# EAGLE design SENSOR CAMERA 003 (EAGLE 5.10)
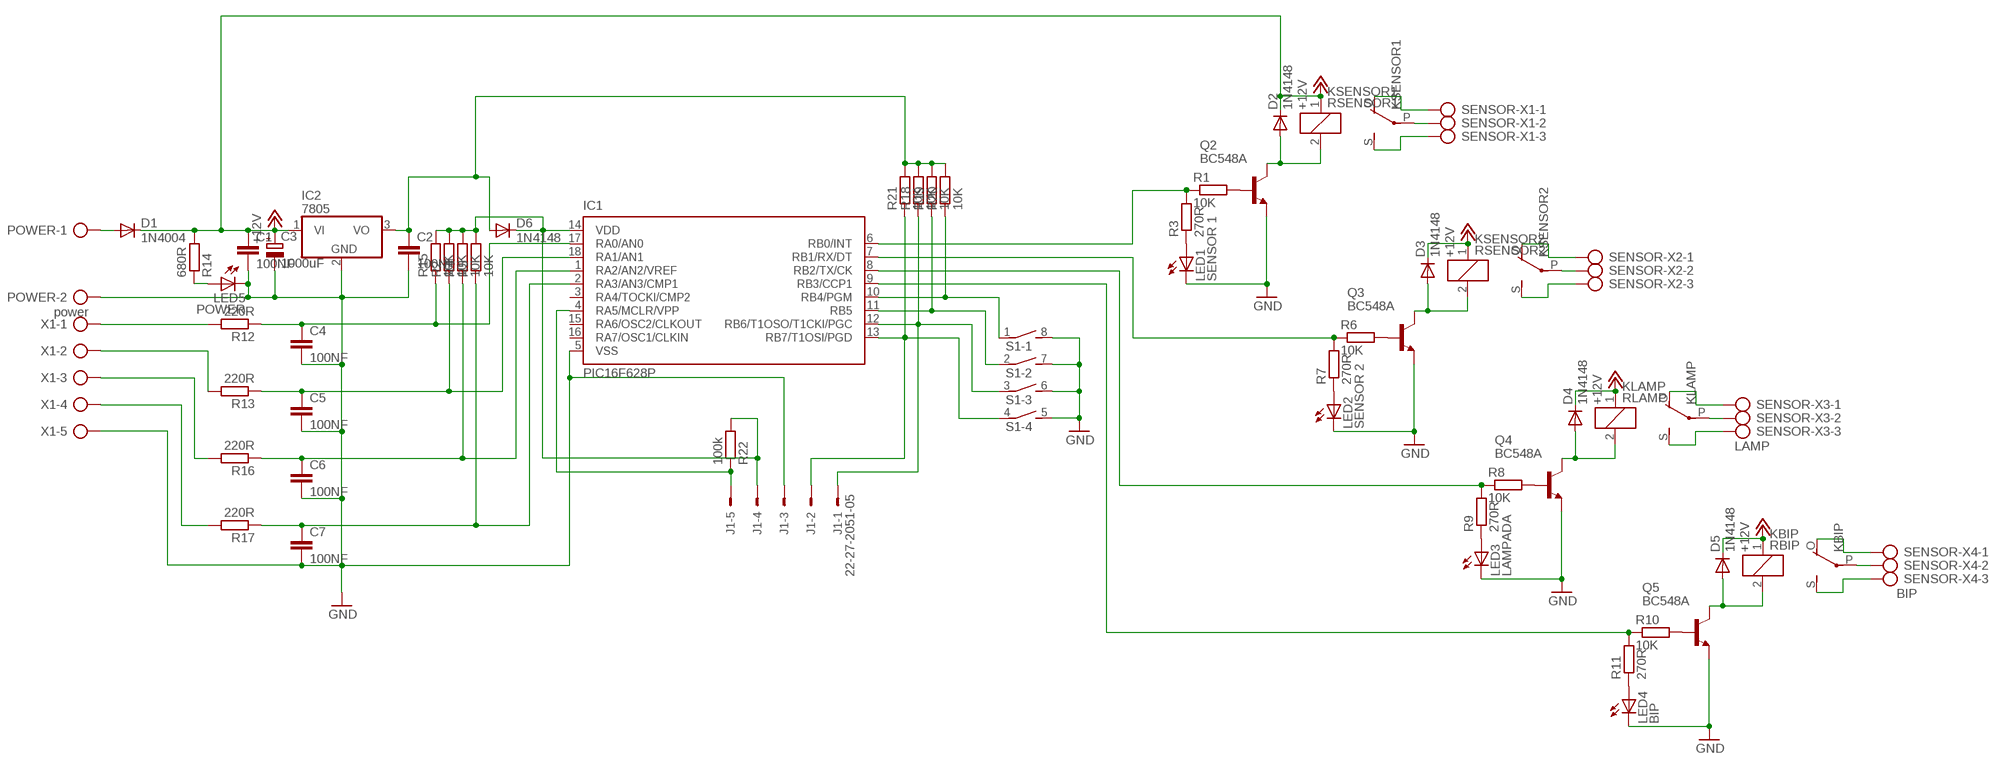
[diagram p0: schematic, sheet 1]

## Parts
C1  100NF  C-EU075-032X103  [C075-032X103]
C2  100NF  C-EU075-032X103  [C075-032X103]
C3  1000uF  CPOL-EUE5-10.5  [E5-10,5]
C4  100NF  C-EU075-032X103  [C075-032X103]
C5  100NF  C-EU075-032X103  [C075-032X103]
C6  100NF  C-EU075-032X103  [C075-032X103]
C7  100NF  C-EU075-032X103  [C075-032X103]
D1  1N4004  [DO41-10]
D2  1N4148  1N4148DO35-7  [DO35-7]
D3  1N4148  1N4148DO35-7  [DO35-7]
D4  1N4148  1N4148DO35-7  [DO35-7]
D5  1N4148  1N4148DO35-7  [DO35-7]
D6  1N4148  1N4148DO35-7  [DO35-7]
IC1  PIC16F628P  [DIL18]
IC2  7805  7805TV  [TO220V]
J1  22-27-2051-05  [6410-05]
KBIP  RBIP  G5LE  [G5LE]
KLAMP  RLAMP  G5LE  [G5LE]
KSENSOR1  RSENSOR1  G5LE  [G5LE]
KSENSOR2  RSENSOR2  G5LE  [G5LE]
LED1  SENSOR 1  LED5MM  [LED5MM]
LED2  SENSOR 2  LED5MM  [LED5MM]
LED3  LAMPADA  LED5MM  [LED5MM]
LED4  BIP  LED5MM  [LED5MM]
LED5  POWER  LED5MM  [LED5MM]
POWER  power  AK500/2-H  [AK500/2-H]
Q2  BC548A  [TO92-EBC]
Q3  BC548A  [TO92-EBC]
Q4  BC548A  [TO92-EBC]
Q5  BC548A  [TO92-EBC]
R1  10K  R-EU_0207/10  [0207/10]
R2  10K  R-EU_0207/10  [0207/10]
R3  270R  R-EU_0207/10  [0207/10]
R4  10K  R-EU_0207/10  [0207/10]
R5  10K  R-EU_0207/10  [0207/10]
R6  10K  R-EU_0207/10  [0207/10]
R7  270R  R-EU_0207/10  [0207/10]
R8  10K  R-EU_0207/10  [0207/10]
R9  270R  R-EU_0207/10  [0207/10]
R10  10K  R-EU_0207/10  [0207/10]
R11  270R  R-EU_0207/10  [0207/10]
R12  220R  R-EU_0207/10  [0207/10]
R13  220R  R-EU_0207/10  [0207/10]
R14  680R  R-EU_0207/10  [0207/10]
R15  10K  R-EU_0207/10  [0207/10]
R16  220R  R-EU_0207/10  [0207/10]
R17  220R  R-EU_0207/10  [0207/10]
R18  10K  R-EU_0207/10  [0207/10]
R19  10K  R-EU_0207/10  [0207/10]
R20  10K  R-EU_0207/10  [0207/10]
R21  10K  R-EU_0207/10  [0207/10]
R22  100k  R-EU_0207/10  [0207/10]
S1  DIP04S  [DIP04S]
SENSOR-X1  AK500/3-H  [AK500/3-H]
SENSOR-X2  AK500/3-H  [AK500/3-H]
SENSOR-X3  LAMP  AK500/3-H  [AK500/3-H]
SENSOR-X4  BIP  AK500/3-H  [AK500/3-H]
X1  AK500/5-H  [AK500/5-H]

## Nets
+12V: C1.1 C3.+ D1.C D2.C D3.C D4.C D5.C IC2.1(VI) KBIP.1 KLAMP.1 KSENSOR1.1 KSENSOR2.1 R14.2
GND: C1.2 C2.2 C3.- C4.2 C5.2 C6.2 C7.2 IC1.5(VSS) IC2.2(GND) J1.3 LED1.K(C) LED2.K(C) LED3.K(C) LED4.K(C) LED5.K(C) POWER.2 Q2.E Q3.E Q4.E Q5.E S1.5 S1.6 S1.7 S1.8 X1.5
N$1: D1.A POWER.1
N$2: C6.1 IC1.1(RA2/AN2/VREF) R4.1 R16.1
N$3: IC1.6(RB0/INT) R1.1 R3.2
N$4: C2.1 D6.A IC2.3(VO) R18.2 R19.2 R20.2 R21.2
N$5: KSENSOR1.P(2:P) SENSOR-X1.2
N$6: KSENSOR1.O(2:O) SENSOR-X1.1
N$7: KSENSOR1.S(2:S) SENSOR-X1.3
N$8: D2.A KSENSOR1.2 Q2.C
N$9: LED1.A R3.1
N$10: Q2.B R1.2
N$11: C7.1 IC1.2(RA3/AN3/CMP1) R5.1 R17.1
N$12: C5.1 IC1.18(RA1/AN1) R2.1 R13.1
N$13: IC1.4(RA5/MCLR/VPP) J1.5 R22.1
N$14: C4.1 IC1.17(RA0/AN0) R12.1 R15.1
N$15: IC1.10(RB4/PGM) R20.1 S1.1
N$16: KSENSOR2.P(2:P) SENSOR-X2.2
N$17: KSENSOR2.O(2:O) SENSOR-X2.1
N$18: KSENSOR2.S(2:S) SENSOR-X2.3
N$19: D3.A KSENSOR2.2 Q3.C
N$20: Q3.B R6.2
N$21: IC1.11(RB5) R19.1 S1.2
N$22: LED2.A R7.1
N$23: KLAMP.P(2:P) SENSOR-X3.2
N$24: KLAMP.O(2:O) SENSOR-X3.1
N$25: KLAMP.S(2:S) SENSOR-X3.3
N$26: D4.A KLAMP.2 Q4.C
N$27: Q4.B R8.2
N$28: IC1.8(RB2/TX/CK) R8.1 R9.2
N$29: LED3.A R9.1
N$30: KBIP.P(2:P) SENSOR-X4.2
N$31: KBIP.O(2:O) SENSOR-X4.1
N$32: KBIP.S(2:S) SENSOR-X4.3
N$33: D5.A KBIP.2 Q5.C
N$34: Q5.B R10.2
N$35: IC1.12(RB6/T1OSO/T1CKI/PGC) J1.1 R18.1 S1.3
N$36: LED4.A R11.1
N$37: IC1.9(RB3/CCP1) R10.1 R11.2
N$38: IC1.7(RB1/RX/DT) R6.1 R7.2
N$39: IC1.13(RB7/T1OSI/PGD) J1.2 R21.1 S1.4
N$40: LED5.A R14.1
N$41: D6.C IC1.14(VDD) J1.4 R2.2 R4.2 R5.2 R15.2 R22.2
N$42: R12.2 X1.1
N$43: R13.2 X1.2
N$44: R16.2 X1.3
N$45: R17.2 X1.4
Unconnected: IC1.3(RA4/TOCKI/CMP2) IC1.15(RA6/OSC2/CLKOUT) IC1.16(RA7/OSC1/CLKIN)

## Library data of the parts
C1 C2 C4-C7 = rcl:C-EU: CAPACITOR, European symbol
C3 = rcl:CPOL-EU: POLARIZED CAPACITOR, European symbol
D1 = diode:1N4004: DIODE general purpose rectifier, 1 A
D2-D6 = diode:1N4148: DIODE high speed (Philips)
IC1 = microchip:PIC16F62*: FLASH-Based 8-Bit CMOS Microcontroller Source: http://ww1.microchip.com/downloads/en/DeviceDoc/40300C.pdf
IC2 = linear:78*: Positive VOLTAGE REGULATOR Source: http://cache.national.com/ds/LM/LM78L05.pdf http://www.fairchildsemi.com/ds/LM/LM7805.pdf
J1 = con-molex:22-?-05: CONNECTOR wire to board 2.54 mm (.1 inch) pitch header
KBIP KLAMP KSENSOR1 KSENSOR2 = relay:G5LE: RELAY 1 x switch, 10 A/120 V AC, 8 A/30 V DC, Omron
LED1-LED5 = led:LED: LED OSRAM: - CHIPLED LG R971, LG N971, LY N971, LG Q971, LY Q971, LO R971, LY R971 LH N974, LH R974 LS Q976, LO Q976, LY Q976 LO Q996 - Hyper CHIPLED LW Q18S LB Q993, LB Q99A, LB R99A - SideLED LS A670, LO A670, LY A670, LG A670, LP A670 LB A673, LV A673, LT A673, LW A673 LH A674 LY A675 LS A676, LA A676, LO A676, LY A676, LW A676 LS A679, LY A679, LG A679 - Hyper Micro SIDELED® LS Y876, LA Y876, LO Y876, LY Y876 LT Y87S - SmartLED LW L88C, LW L88S LB L89C, LB L89S, LG L890 LS L89K, LO L89K, LY L89K LS L896, LA L896, LO L896, LY L896 - TOPLED LS T670, LO T670, LY T670, LG T670, LP T670 LSG T670, LSP T670, LSY T670, LOP T670, LYG T670 LG T671, LOG T671, LSG T671 LB T673, LV T673, LT T673, LW T673 LH T674 LS T676, LA T676, LO T676, LY T676, LB T676, LH T676, LSB T676, LW T676 LB T67C, LV T67C, LT T67C, LS T67K, LO T67K, LY T67K, LW E67C LS E67B, LA E67B, LO E67B, LY E67B, LB E67C, LV E67C, LT E67C LW T67C LS T679, LY T679, LG T679 LS T770, LO T770, LY T770, LG T770, LP T770 LB T773, LV T773, LT T773, LW T773 LH T774 LS E675, LA E675, LY E675, LS T675 LS T776, LA T776, LO T776, LY T776, LB T776 LHGB T686 LT T68C, LB T68C - Hyper Mini TOPLED® LB M676 - Mini TOPLED Santana® LG M470 LS M47K, LO M47K, LY M47K Source: http://www.osram.convergy.de LUXEON: - LUMILED® LXK2-PW12-R00, LXK2-PW12-S00, LXK2-PW14-U00, LXK2-PW14-V00 LXK2-PM12-R00, LXK2-PM12-S00, LXK2-PM14-U00 LXK2-PE12-Q00, LXK2-PE12-R00, LXK2-PE12-S00, LXK2-PE14-T00, LXK2-PE14-U00 LXK2-PB12-K00, LXK2-PB12-L00, LXK2-PB12-M00, LXK2-PB14-N00, LXK2-PB14-P00, LXK2-PB14-Q00 LXK2-PR12-L00, LXK2-PR12-M00, LXK2-PR14-Q00, LXK2-PR14-R00 LXK2-PD12-Q00, LXK2-PD12-R00, LXK2-PD12-S00 LXK2-PH12-R00, LXK2-PH12-S00 LXK2-PL12-P00, LXK2-PL12-Q00, LXK2-PL12-R00 Source: www.luxeon.com KINGBRIGHT: KA-3528ASYC Source: www.kingbright.com
POWER = con-ptr500:AK500/2-H: CONNECTOR Aug. 2004 / PTR Meßtechnik: Die Bezeichnung der Serie AK505 wurde geändert. Es handelt sich hierbei um AK500 in horizontaler Ausführung.
Q2-Q5 = transistor-npn:BC548*: NPN Transistor
R1-R22 = rcl:R-EU_: RESISTOR, European symbol
S1 = switch-dil:DIP04S: DIL/CODE SWITCH
SENSOR-X1-SENSOR-X4 = con-ptr500:AK500/3-H: CONNECTOR Aug. 2004 / PTR Meßtechnik: Die Bezeichnung der Serie AK505 wurde geändert. Es handelt sich hierbei um AK500 in horizontaler Ausführung.
X1 = con-ptr500:AK500/5-H: CONNECTOR Aug. 2004 / PTR Meßtechnik: Die Bezeichnung der Serie AK505 wurde geändert. Es handelt sich hierbei um AK500 in horizontaler Ausführung.

## Board
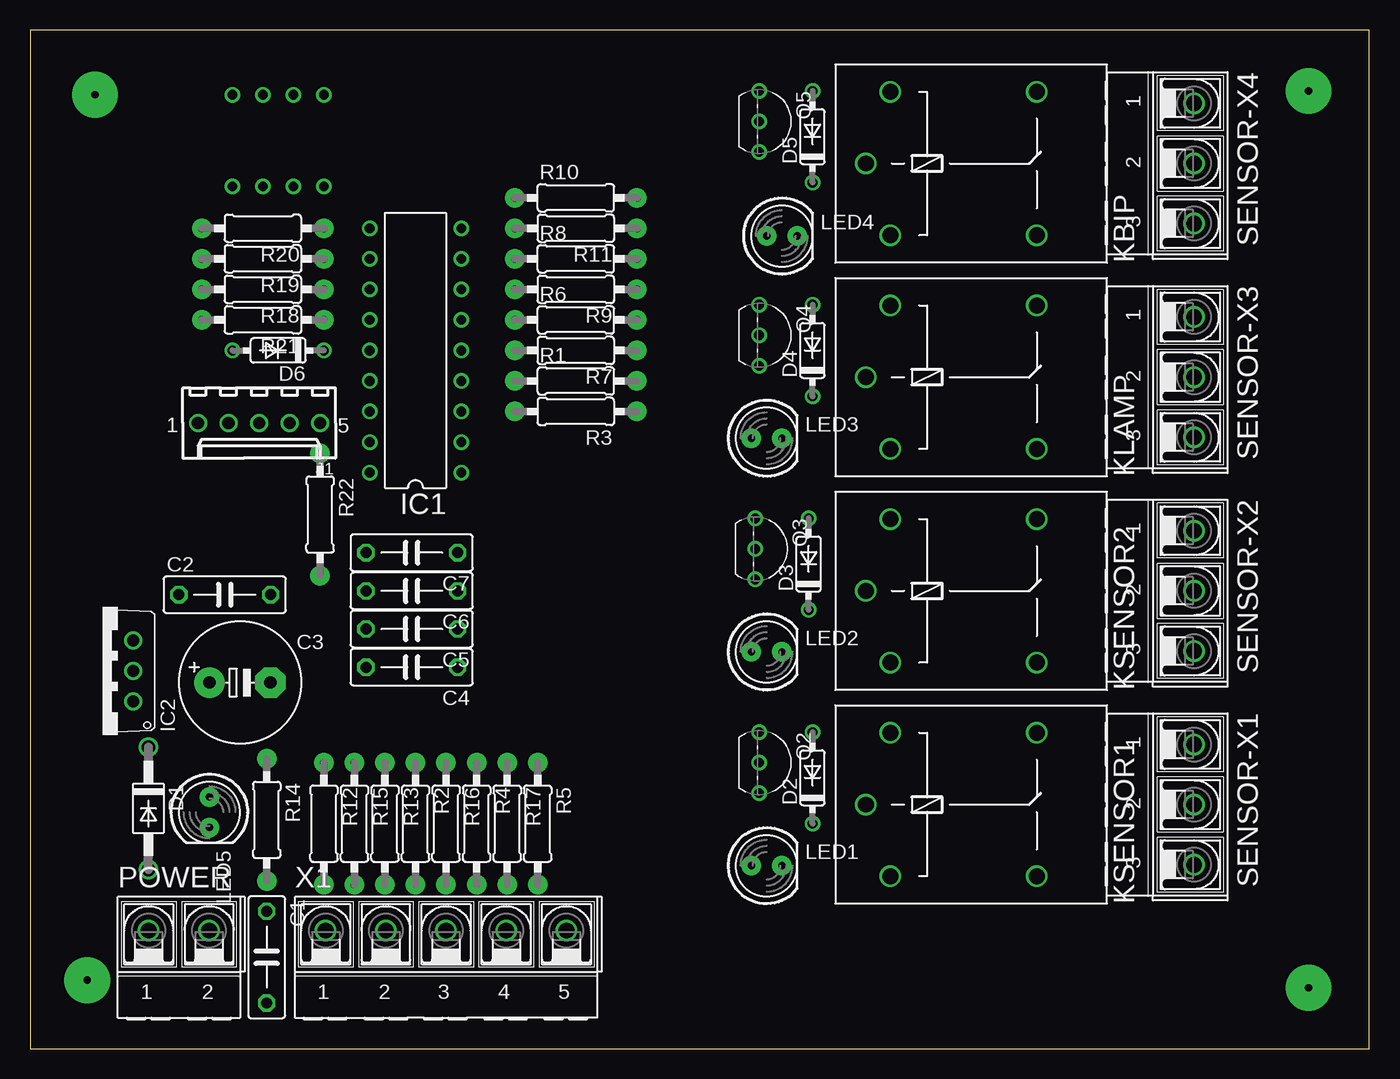
[diagram p1: board, top side]
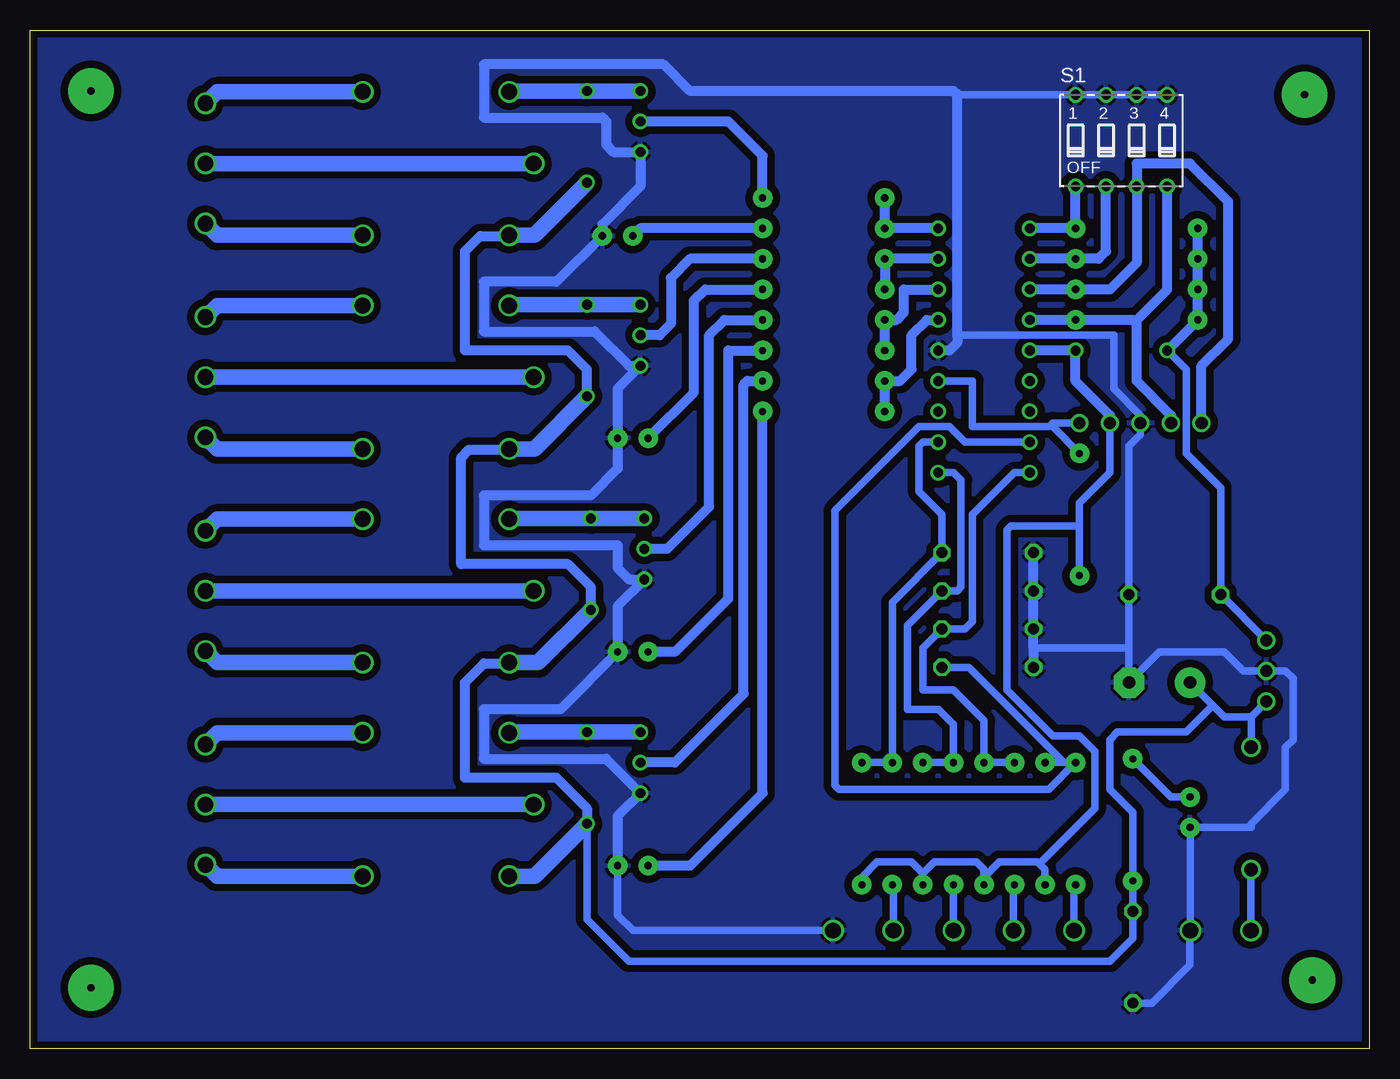
[diagram p2: board, bottom side, seen from below]

Size 111.42 x 84.76 mm. Coordinates in mm from the lower left corner, seen from the top.
Outline: 0,0 111.42,0 111.42,84.76 0,84.76 0,0
Copper layers (1*16): Top 0.035mm / dielectric 1.5mm / Bottom 0.035mm
Design rules "MUITO BOM FONTE *": minimum track width 25mil, minimum drill 5mil, track to track 10mil, track to pad 10mil, pad to pad 10mil, via to via 10mil, smd to smd 10mil, copper to edge 10mil, drill to drill 10mil, minimum pad ring 10mil, minimum via ring 10mil, stop-mask expansion 4mil, vias tented up to drill 0mil, thermal gap 10mil

### Footprints (pad centres in the part's own frame; a part is rotated, then mirrored left to right if it is on the bottom)
C075-032X103 = drill 0.914 octagon: 1 -3.81,0; 2 3.81,0
E5-10,5 = drill 1.016 pad 2.54 round: + -2.54,0 | drill 1.016 pad 2.54 octagon: - 2.54,0
DO41-10 = drill 1.118 round: A 5.08,0; C -5.08,0
DO35-7 = drill 0.813 long: A 3.81,0; C -3.81,0
DIL18 = drill 0.813 long: 1 -10.16,-3.81; 2 -7.62,-3.81; 3 -5.08,-3.81; 4 -2.54,-3.81; 5 0,-3.81; 6 2.54,-3.81; 7 5.08,-3.81; 8 7.62,-3.81; 9 10.16,-3.81; 10 10.16,3.81; 11 7.62,3.81; 12 5.08,3.81; 13 2.54,3.81; 14 0,3.81; 15 -2.54,3.81; 16 -5.08,3.81; 17 -7.62,3.81; 18 -10.16,3.81
TO220V = drill 1.016 long: 1 -2.54,-2.54; 2 0,-2.54; 3 2.54,-2.54
6410-05 = drill 1.016 long: 1 5.08,0; 2 2.54,0; 3 0,0; 4 -2.54,0; 5 -5.08,0
G5LE = drill 1.321 long: 1 -7.493,-5.969; 2 -7.493,5.969; O 4.699,5.969; P -9.525,0; S 4.699,-5.969
LED5MM = drill 0.6 pad 1.676 long: A -1.27,0; K 1.27,0
AK500/2-H = drill 1.321 long: 1 -2.515,0; 2 2.515,0
TO92-EBC = drill 0.813 long: B 0,-1.27; C -2.54,-1.27; E 2.54,-1.27
0207/10 = drill 0.6 pad 1.676 offset: 1 -5.08,0; 2 5.08,0
DIP04S = drill 0.813 long: 1 -3.81,-3.81; 2 -1.27,-3.81; 3 1.27,-3.81; 4 3.81,-3.81; 5 3.81,3.81; 6 1.27,3.81; 7 -1.27,3.81; 8 -3.81,3.81
AK500/3-H = drill 1.321 long: 1 -5.004,0; 2 0,0; 3 5.004,0
AK500/5-H = drill 1.321 long: 1 -10.033,0; 2 -5.004,0; 3 0,0; 4 5.004,0; 5 10.008,0

### Placement (x,y rotation side)
C1  19.68,7.62 270 top
C2  16.19,37.78 0 top
C3  17.46,30.48 0 top
C4  31.75,31.75 180 top
C5  31.75,34.92 180 top
C6  31.75,38.1 180 top
C7  31.75,41.27 180 top
D1  9.84,20 270 top
D2  65.09,22.54 90 top
D3  64.77,40.32 90 top
D4  65.09,58.1 90 top
D5  65.09,75.88 90 top
D6  20.64,58.1 180 top
IC1  32.07,58.1 90 top
IC2  6.03,31.43 90 top
J1  19.05,52.07 180 top
KBIP  79.06,73.66 0 top
KLAMP  79.06,55.88 0 top
KSENSOR1  79.06,20.32 0 top
KSENSOR2  79.06,38.1 0 top
LED1  61.28,15.24 0 top
LED2  61.28,33.02 0 top
LED3  61.28,50.8 0 top
LED4  62.55,67.63 0 top
LED5  14.92,19.68 270 top
POWER  12.38,9.84 0 top
Q2  61.91,23.81 270 top
Q3  61.59,41.59 270 top
Q4  61.91,59.37 270 top
Q5  61.91,77.15 270 top
R1  45.4,55.56 0 top
R2  32.07,18.73 270 top
R3  45.4,53.02 180 top
R4  37.15,18.73 270 top
R5  42.23,18.73 270 top
R6  45.4,60.64 0 top
R7  45.4,58.1 180 top
R8  45.4,65.72 0 top
R9  45.4,63.18 180 top
R10  45.4,70.8 0 top
R11  45.4,68.26 180 top
R12  24.45,18.73 270 top
R13  29.53,18.73 270 top
R14  19.68,19.05 270 top
R15  26.99,18.73 270 top
R16  34.61,18.73 270 top
R17  39.69,18.73 270 top
R18  19.37,63.18 180 top
R19  19.37,65.72 180 top
R20  19.37,68.26 180 top
R21  19.37,60.64 180 top
R22  24.13,44.45 270 top
S1  20.64,75.56 0 bottom
SENSOR-X1  96.84,20.32 270 top
SENSOR-X2  96.84,38.1 270 top
SENSOR-X3  96.84,55.88 270 top
SENSOR-X4  96.84,73.66 270 top
X1  34.61,9.84 0 top

### Tracks (layer width: path | path; a pad name or v marks a point on that pad's centre or on a via)
+12V
  Bottom 0.61: 9.84,27.62 D1.C | 9.84,27.62 IC2.1 | 9.84,27.62 12.06,27.62 13.02,28.57 | 13.02,28.57 C3.+ | 13.02,28.57 15.24,26.35 20.95,26.35 21.59,25.72 21.59,21.59 19.68,19.68 R14.2 C1.1 19.68,9.21 21.59,7.3 61.59,7.3 65.09,10.79 65.09,20
  Bottom 0.813: D2.C 65.09,20 67.63,22.54 75.25,22.54 75.25,30.48 73.66,32.07 71.63,32.07 KSENSOR2.1 | D3.C 64.77,38.42 66.67,40.32 75.56,40.32 75.56,49.21 74.93,49.85 71.63,49.85 KLAMP.1 | D4.C 65.09,56.52 66.67,58.1 75.25,58.1 75.25,66.36 73.98,67.63 71.63,67.63 KBIP.1
  Bottom 1.27: KSENSOR1.1 69.47,14.35 D2.C | KSENSOR2.1 69.15,32.13 D3.C | KLAMP.1 69.47,49.91 D4.C | KBIP.1 69.47,67.69 D5.C
GND
  Bottom 0.61: J1.3 19.05,52.7 21.27,54.93 21.27,59.37 34.29,59.37 | S1.5 S1.6 S1.7 S1.8 34.29,79.38 | C1.2 18.1,3.81 14.92,6.99 14.92,9.82 POWER.2 14.9,18.39 LED5.K 9.84,18.41 9.84,18.73 6.99,21.59 6.99,25.08 6.35,25.72 6.35,30.8 6.99,31.43 IC2.2 10.48,31.43 12.06,33.02 17.46,33.02 C3.- 20,33.34 C2.2 | X1.5 61.28,9.84 62.55,11.11 LED1.K
  Bottom 0.635: 20,33.34 27.94,33.34 | C2.2 20,50.16 19.05,51.12 J1.3
  Bottom 0.813: LED1.K 62.55,19.37 Q2.E 63.5,24.13 73.66,24.13 73.66,28.26 67.31,28.26 LED2.K 62.55,36.83 Q3.E 61.59,39.05 62.55,40.01 62.55,41.91 73.66,41.91 73.66,46.04 64.77,46.04 62.55,48.26 LED3.K 62.55,54.93 Q4.E 61.59,56.83 64.45,59.69 73.66,59.69 73.66,63.82 67.63,63.82 LED4.K 63.82,68.58 60.64,71.75 Q5.E 62.87,74.61 63.5,75.25 63.5,77.15 63.82,77.47 73.66,77.47 73.66,81.92 58.74,81.92 56.52,79.69 34.61,79.69 34.29,79.38 34.29,59.37 34.29,58.74 34.92,58.1 IC1.5 | C6.2 27.62,37.78 | C4.2 27.94,33.34 C5.2 C6.2 | C6.2 C7.2
  pour Bottom (isolate 0.61): 0,84.77 111.44,84.77 111.44,0 0,0
N$1
  Bottom 0.61: POWER.1 9.87,14.9 D1.A
N$2
  Bottom 0.61: R4.1 R16.1 34.61,26.99 35.88,28.26 38.42,28.26 38.42,35.24 C6.1 34.29,38.1 33.97,38.42 33.97,47.31 34.61,47.94 IC1.1
N$3
  Bottom 0.813: IC1.6 36.83,60.64 38.1,59.37 38.1,56.52 39.05,55.56 R1.1 R3.2
N$4
  Bottom 0.61: D6.A 15.24,56.52 15.24,49.53 12.38,46.67 C2.1 IC2.3
  Bottom 0.813: D6.A R21.2 R18.2 R19.2 R20.2
N$5
  Bottom 1.27: KSENSOR1.P SENSOR-X1.2
N$6
  Bottom 1.27: KSENSOR1.O 95.87,26.29 SENSOR-X1.1
N$7
  Bottom 1.27: KSENSOR1.S 95.87,14.35 SENSOR-X1.3
N$8
  Bottom 1.27: Q2.C D2.A 71.5,26.35 KSENSOR1.2
N$9
  Bottom 0.813: R3.1 50.48,21.27 56.52,15.24 LED1.A
N$10
  Bottom 0.813: R1.2 51.75,55.56 52.07,55.24 52.07,29.53 57.78,23.81 Q2.B
N$11
  Bottom 0.61: R5.1 R17.1 39.69,37.15 C7.1 35.56,44.45 37.47,46.35 37.47,50.16 37.15,50.48 IC1.2
N$12
  Bottom 0.61: R13.1 R2.1 32.07,27.3 34.61,29.84 37.15,29.84 37.15,33.34 C5.1 33.66,34.92 33.02,35.56 33.02,44.45 29.53,47.94 IC1.18
N$13
  Bottom 0.61: J1.5 26.35,52.07 26.51,51.91 26.67,51.75 33.02,51.75 33.02,55.56 IC1.4
  Bottom 0.635: R22.1 26.35,51.75 26.51,51.91
N$14
  Bottom 0.61: R12.1 25.4,23.81 R15.1
  Bottom 0.635: IC1.17 33.66,50.48 34.92,51.75 37.47,51.75 44.45,44.77 44.45,21.91 44.13,21.59 26.67,21.59 R12.1 | C4.1 33.34,31.75 25.4,23.81
N$15
  Bottom 0.813: IC1.10 R20.1 S1.1
N$16
  Bottom 1.27: KSENSOR2.P SENSOR-X2.2
N$17
  Bottom 1.27: KSENSOR2.O 95.87,44.07 SENSOR-X2.1
N$18
  Bottom 1.27: KSENSOR2.S 95.87,32.13 SENSOR-X2.3
N$19
  Bottom 1.27: Q3.C D3.A 71.5,44.13 KSENSOR2.2
N$20
  Bottom 0.813: R6.2 53.66,60.64 54.93,59.37 54.93,45.09 58.42,41.59 Q3.B
N$21
  Bottom 0.813: IC1.11 R19.1 22.54,65.72 21.91,66.36 S1.2
N$22
  Bottom 0.813: R7.1 53.34,58.1 53.34,37.47 57.78,33.02 LED2.A
N$23
  Bottom 1.27: KLAMP.P SENSOR-X3.2
N$24
  Bottom 1.27: KLAMP.O 95.87,61.85 SENSOR-X3.1
N$25
  Bottom 1.27: KLAMP.S 95.87,49.91 SENSOR-X3.3
N$26
  Bottom 1.27: Q4.C D4.A 71.5,61.91 KLAMP.2
N$27
  Bottom 0.813: R8.2 56.52,65.72 58.1,64.14 58.1,60.33 59.05,59.37 Q4.B
N$28
  Bottom 0.813: IC1.8 R8.1 R9.2
N$29
  Bottom 0.813: R9.1 55.24,63.18 56.2,62.23 56.2,54.61 LED3.A
N$30
  Bottom 1.27: KBIP.P SENSOR-X4.2
N$31
  Bottom 1.27: KBIP.O 95.87,79.63 SENSOR-X4.1
N$32
  Bottom 1.27: KBIP.S 95.87,67.69 SENSOR-X4.3
N$33
  Bottom 1.27: Q5.C D5.A 71.5,79.69 KBIP.2
N$34
  Bottom 0.813: R10.2 50.48,74.3 53.34,77.15 Q5.B
N$35
  Bottom 0.813: IC1.12 R18.1 21.59,63.18 19.37,65.41 S1.3 19.37,73.66 14.92,73.66 11.75,70.48 11.75,59.05 13.97,56.83 J1.1
N$36
  Bottom 0.813: R11.1 60.64,68.26 LED4.A
N$37
  Bottom 0.813: IC1.9 R11.2 R10.1
N$38
  Bottom 0.813: IC1.7 38.73,63.18 38.73,61.28 39.37,60.64 R6.1 R7.2
N$39
  Bottom 0.813: IC1.13 R21.1 19.68,60.64 | S1.4 16.83,63.18 19.37,60.64 19.68,60.64 | J1.2 16.51,52.7 19.37,55.56 19.37,60.33 19.68,60.64
N$40
  Bottom 0.61: LED5.A 16.51,20.95 R14.1
N$41
  Bottom 0.61: R5.2 42.23,14.29 40.96,15.56 38.1,15.56 37.15,14.61 | 37.15,14.61 R4.2 | 37.15,14.61 36.2,15.56 32.7,15.56 32.07,14.92 R2.2 32.07,14.29 30.8,15.56 27.62,15.56 27.46,15.4 26.99,14.92 R15.2
  Bottom 0.635: 27.46,15.4 27.3,15.56 22.86,20 22.86,24.77 24.13,26.04 26.35,26.04 30.16,29.84 30.16,43.18 29.84,43.5 24.13,43.5 | 24.13,43.5 24.13,45.4 21.59,47.94 21.59,51.75 J1.4 | 24.13,43.5 R22.2
  Bottom 0.813: IC1.14 D6.C 24.45,55.56 21.59,52.7 J1.4
N$42
  Bottom 0.61: X1.1 24.57,13.53 R12.2
N$43
  Bottom 0.61: X1.2 29.6,13.58 R13.2
N$44
  Bottom 0.61: X1.3 R16.2
N$45
  Bottom 0.61: X1.4 39.61,13.58 R17.2
N$46  (via drill 0.6 pad 3.81)
  other vias: 106.36,79.69
N$47  (via drill 0.6 pad 3.81)
  other vias: 5.4,79.38
N$48  (via drill 0.6 pad 3.81)
  other vias: 4.76,5.71
N$49  (via drill 0.6 pad 3.81)
  other vias: 106.36,5.08